# EAGLE schematic Generador de Funciones (EAGLE 9.0.1)
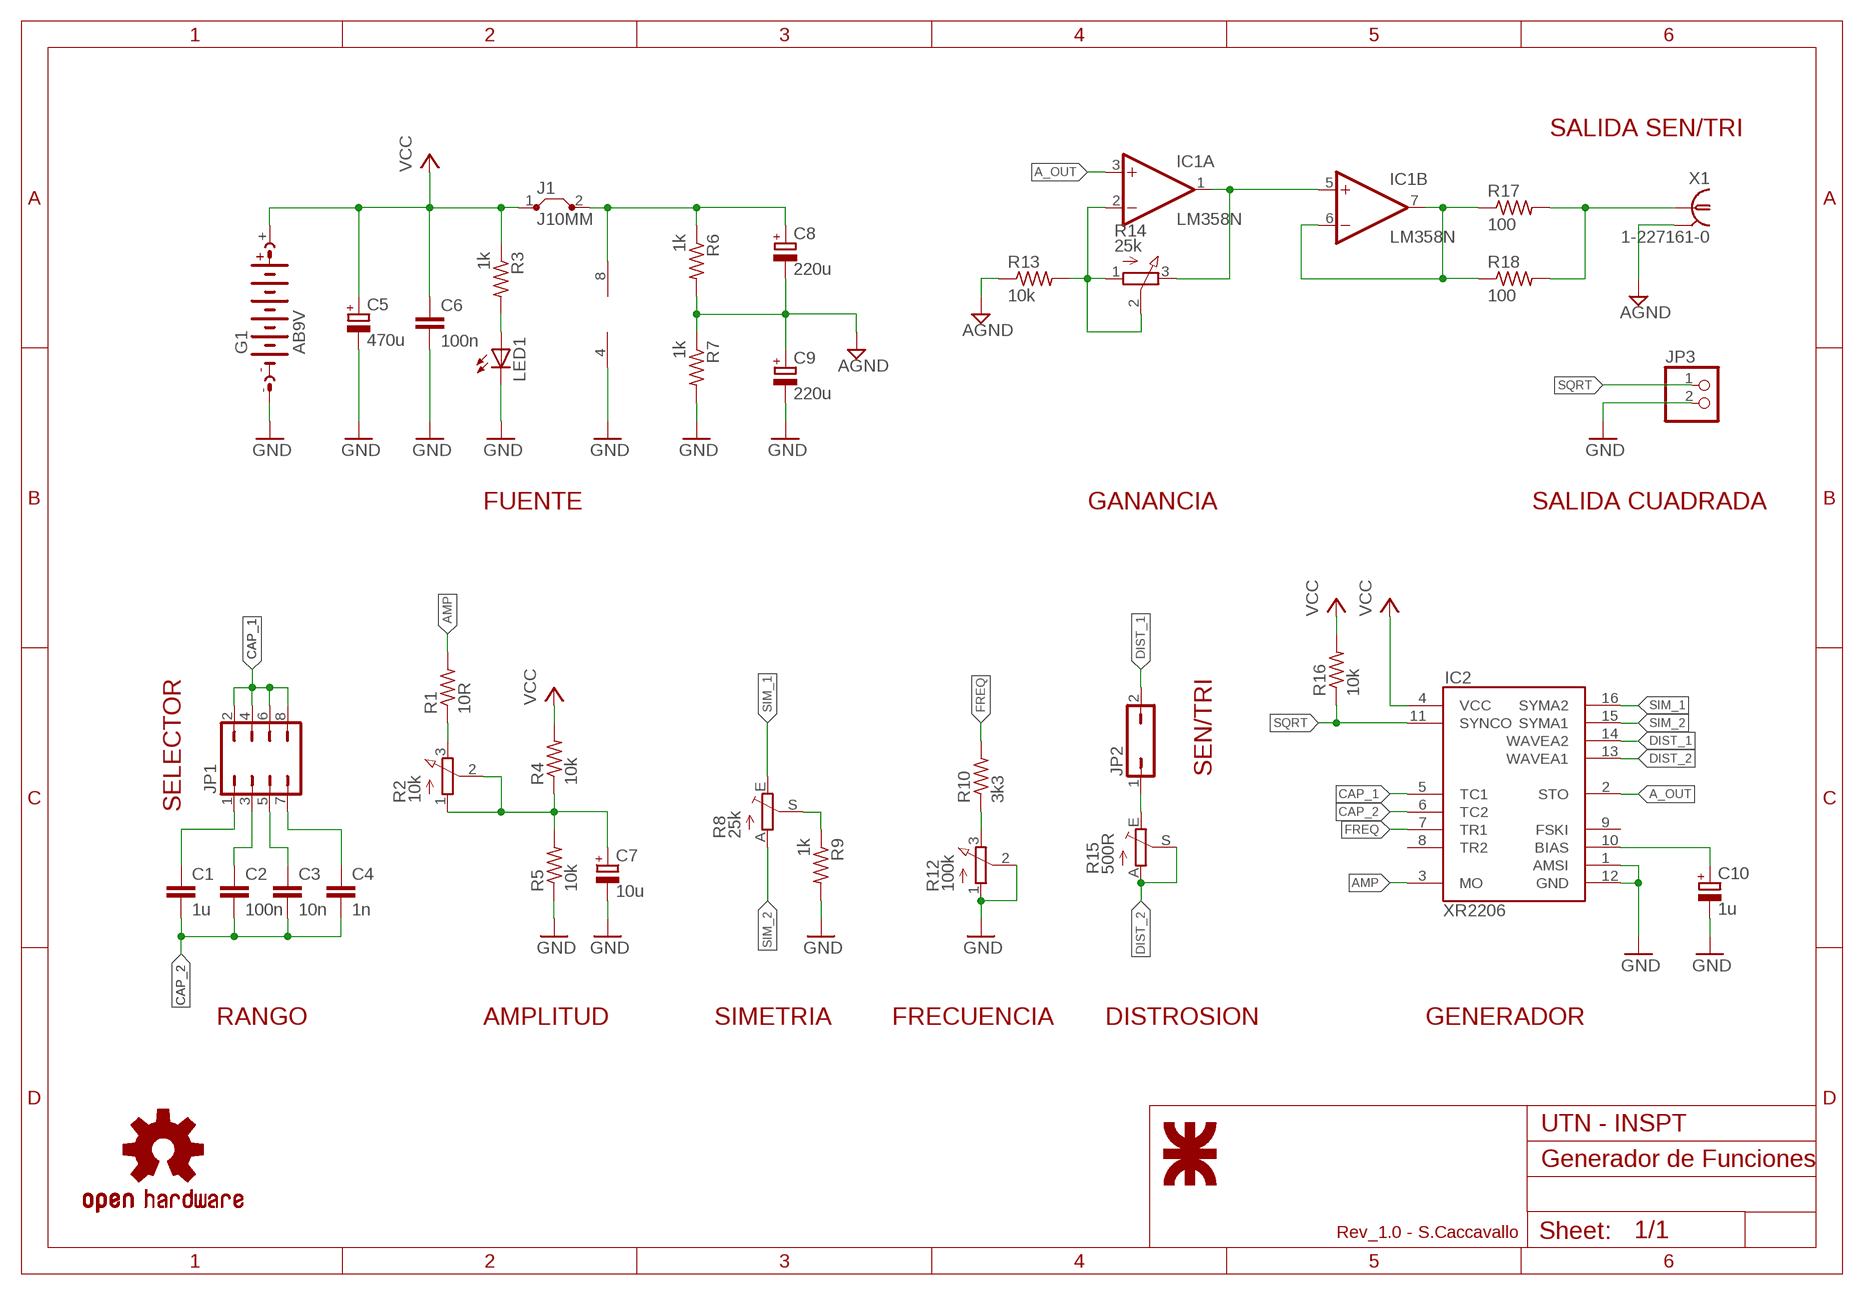
[diagram p0: schematic, sheet 1]

## Parts
C1  1u  C-EU050-024X044  [C050-024X044]
C2  100n  C-EU050-024X044  [C050-024X044]
C3  10n  C-EU050-024X044  [C050-024X044]
C4  1n  C-EU050-024X044  [C050-024X044]
C5  470u  CPOL-EUE3.5-8  [E3,5-8]
C6  100n  C-EU050-024X044  [C050-024X044]
C7  10u  CPOL-EUE2.5-6  [E2,5-6]
C8  220u  CPOL-EUE3.5-8  [E3,5-8]
C9  220u  CPOL-EUE3.5-8  [E3,5-8]
C10  1u  CPOL-EUE2.5-6  [E2,5-6]
G1  AB9V  [AB9V]
IC1  LM358N  [DIL08]
IC2  XR2206  [DIL16]
J1  J10MM  [10]
JP1  JP4Q  [JP4Q]
JP2  JP1Q  [JP1]
JP3  PINHD-1X2  [1X02]
LED1  LED5MM  [LED5MM]
R1  10R  R-US_0204/7  [0204/7]
R2  10k  3RP/1610N  [3RP/1610N]
R3  1k  R-US_0204/7  [0204/7]
R4  10k  R-US_0204/7  [0204/7]
R5  10k  R-US_0204/7  [0204/7]
R6  1k  R-US_0204/7  [0204/7]
R7  1k  R-US_0204/7  [0204/7]
R8  25k  TRIM_EU-RJ9W  [RJ9W]
R9  1k  R-US_0204/7  [0204/7]
R10  3k3  R-US_0204/7  [0204/7]
R12  100k  3RP/1610N  [3RP/1610N]
R13  10k  R-US_0204/7  [0204/7]
R14  25k  3RP/1610N  [3RP/1610N]
R15  500R  TRIM_EU-RJ9W  [RJ9W]
R16  10k  R-US_0204/7  [0204/7]
R17  100  R-US_0204/7  [0204/7]
R18  100  R-US_0204/7  [0204/7]
U$1  UTN_LOGO_0  [UTN_LOGO_0_TOP]
U$4  OSHW-LOGOL  [OSHW-LOGO-L]
X1  1-227161-0  [AMP_227161]

## Nets
A_OUT: IC1.3(A:+IN) IC2.2(STO)
AGND: C8.- C9.+ R6.2 R7.1 R13.1 X1.2
AMP: IC2.3(MO) R1.2
CAP_1: IC2.5(TC1) JP1.2 JP1.4 JP1.6 JP1.8
CAP_2: C1.2 C2.2 C3.2 C4.2 IC2.6(TC2)
DIST_1: IC2.14(WAVEA2) JP2.2
DIST_2: IC2.13(WAVEA1) R15.A R15.S
FREQ: IC2.7(TR1) R10.2
GND: C5.- C6.2 C7.- C9.- C10.- G1.- IC1.4(P:V-) IC2.1(AMSI) IC2.12(GND) JP3.2 LED1.K(C) R5.1 R7.2 R9.2 R12.1(A) R12.2(S)
N$1: IC1.2(A:-IN) R13.2 R14.1(A) R14.2(S)
N$2: R1.1 R2.3(E)
N$3: R10.1 R12.3(E)
N$5: C1.1 JP1.1
N$6: C2.1 JP1.3
N$7: C10.+ IC2.10(BIAS)
N$8: R8.S R9.1
N$9: C3.1 JP1.5
N$10: C4.1 JP1.7
N$11: R17.2 R18.2 X1.1
N$12: LED1.A R3.2
N$13: JP2.1 R15.E
N$15: C7.+ R2.1(A) R2.2(S) R4.1 R5.2
N$16: IC1.1(A:OUT) IC1.5(B:+IN) R14.3(E)
N$17: IC1.6(B:-IN) IC1.7(B:OUT) R17.1 R18.1
N$18: C8.+ IC1.8(P:V+) J1.2 R6.1
SIM_1: IC2.16(SYMA2) R8.E
SIM_2: IC2.15(SYMA1) R8.A
SQRT: IC2.11(SYNCO) JP3.1 R16.1
VCC: C5.+ C6.1 G1.+ IC2.4(VCC) J1.1 R3.1 R4.2 R16.2
Unconnected: IC2.8(TR2) IC2.9(FSKI)

## Notes on the sheet
- SALIDA SEN/TRI
- FUENTE | GANANCIA | SALIDA CUADRADA
- SEN/TRI
- SELECTOR
- RANGO | AMPLITUD | SIMETRIA | FRECUENCIA | DISTROSION | GENERADOR
- UTN - INSPT
- Rev_1.0 - S.Caccavallo

## Library data of the parts
C1-C4 C6 = rcl:C-EU: CAPACITOR, European symbol; SPICEPREFIX: C
C5 C7-C10 = rcl:CPOL-EU: POLARIZED CAPACITOR, European symbol; SPICEPREFIX: C
G1 = battery:AB9V: 9-V BATTERY CLIP
IC1 = linear:LM358: OP AMP also LM158; LM258; LM2904 Source: http://cache.national.com/ds/LM/LM158.pdf
IC2 = SparkFun:XR2206: XR2206 Monolithic Function Generator
J1 = jumper:J: Bridge
JP1 = jumper:JP4Q: JUMPER
JP2 = jumper:JP1Q: JUMPER
JP3 = pinhead:PINHD-1X2: PIN HEADER
LED1 = led:LED: LED OSRAM: - CHIPLED LG R971, LG N971, LY N971, LG Q971, LY Q971, LO R971, LY R971 LH N974, LH R974 LS Q976, LO Q976, LY Q976 LO Q996 - Hyper CHIPLED LW Q18S LB Q993, LB Q99A, LB R99A - SideLED LS A670, LO A670, LY A670, LG A670, LP A670 LB A673, LV A673, LT A673, LW A673 LH A674 LY A675 LS A676, LA A676, LO A676, LY A676, LW A676 LS A679, LY A679, LG A679 - Hyper Micro SIDELED® LS Y876, LA Y876, LO Y876, LY Y876 LT Y87S - SmartLED LW L88C, LW L88S LB L89C, LB L89S, LG L890 LS L89K, LO L89K, LY L89K LS L896, LA L896, LO L896, LY L896 - TOPLED LS T670, LO T670, LY T670, LG T670, LP T670 LSG T670, LSP T670, LSY T670, LOP T670, LYG T670 LG T671, LOG T671, LSG T671 LB T673, LV T673, LT T673, LW T673 LH T674 LS T676, LA T676, LO T676, LY T676, LB T676, LH T676, LSB T676, LW T676 LB T67C, LV T67C, LT T67C, LS T67K, LO T67K, LY T67K, LW E67C LS E67B, LA E67B, LO E67B, LY E67B, LB E67C, LV E67C, LT E67C LW T67C LS T679, LY T679, LG T679 LS T770, LO T770, LY T770, LG T770, LP T770 LB T773, LV T773, LT T773, LW T773 LH T774 LS E675, LA E675, LY E675, LS T675 LS T776, LA T776, LO T776, LY T776, LB T776 LHGB T686 LT T68C, LB T68C - Hyper Mini TOPLED® LB M676 - Mini TOPLED Santana® LG M470 LS M47K, LO M47K, LY M47K Source: http://www.osram.convergy.de LUXEON: - LUMILED® LXK2-PW12-R00, LXK2-PW12-S00, LXK2-PW14-U00, LXK2-PW14-V00 LXK2-PM12-R00, LXK2-PM12-S00, LXK2-PM14-U00 LXK2-PE12-Q00, LXK2-PE12-R00, LXK2-PE12-S00, LXK2-PE14-T00, LXK2-PE14-U00 LXK2-PB12-K00, LXK2-PB12-L00, LXK2-PB12-M00, LXK2-PB14-N00, LXK2-PB14-P00, LXK2-PB14-Q00 LXK2-PR12-L00, LXK2-PR12-M00, LXK2-PR14-Q00, LXK2-PR14-R00 LXK2-PD12-Q00, LXK2-PD12-R00, LXK2-PD12-S00 LXK2-PH12-R00, LXK2-PH12-S00 LXK2-PL12-P00, LXK2-PL12-Q00, LXK2-PL12-R00 Source: www.luxeon.com KINGBRIGHT: KA-3528ASYC Source: www.kingbright.com
R1 R3-R7 R9 R10 R13 R16-R18 = rcl:R-US_: RESISTOR, American symbol; SPICEPREFIX: R
R2 R12 R14 = pot:3RP/1610N: 16mm Potentiometer one level Source: http://www.alphapotentiometers.net/html/16mm_pot_2.html
R8 R15 = pot:TRIM_EU-: POTENTIOMETER
U$1 = UTN_LOGO:UTN_LOGO_0
U$4 = SparkFun-Aesthetics:OSHW-LOGO: Open Source Hardware Logo This logo indicates the piece of hardware it is found on incorporates a OSHW license and/or adheres to the definition of open source hardware found here: http://freedomdefined.org/OSHW
X1 = con-coax:?227161*: JACK, RIGHT ANGLE, 50 OHM, PCB, BNC Source: amp_227161.pdf; MF: TYCO ELECTRONICS; MPN: 1-227161; OC_FARNELL: unknown; OC_NEWARK: 33B3200